# EAGLE design top plank (EAGLE 6.2)
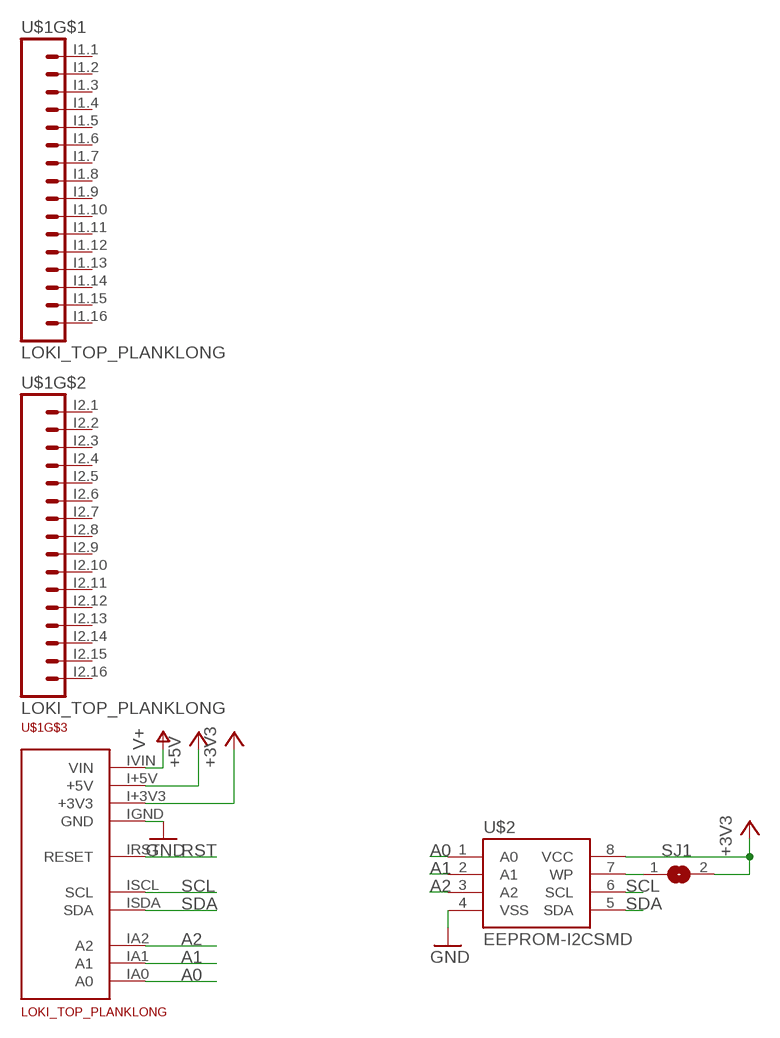
[diagram p0: schematic, sheet 1]

## Parts
SJ1  SJ  [SJ]
U$1  LOKI_TOP_PLANKLONG  [TOP_PLANK_LONG]
U$2  EEPROM-I2CSMD  [SO08]

## Nets
+3V3: SJ1.2 U$1.I+3V3(+3V3) U$2.8(VCC)
+5V: U$1.I+5V(+5V)
A0: U$1.IA0(A0) U$2.1(A0)
A1: U$1.IA1(A1) U$2.2(A1)
A2: U$1.IA2(A2) U$2.3(A2)
GND: U$1.IGND(GND) U$2.4(VSS)
N$1: SJ1.1 U$2.7(WP)
RST: U$1.IRST(RESET)
SCL: U$1.ISCL(SCL) U$2.6(SCL)
SDA: U$1.ISDA(SDA) U$2.5(SDA)
V+: U$1.IVIN(VIN)
Unconnected: U$1.I1.1 U$1.I1.2 U$1.I1.3 U$1.I1.4 U$1.I1.5 U$1.I1.6 U$1.I1.7 U$1.I1.8 U$1.I1.9 U$1.I1.10 U$1.I1.11 U$1.I1.12 U$1.I1.13 U$1.I1.14 U$1.I1.15 U$1.I1.16 U$1.I2.1 U$1.I2.2 U$1.I2.3 U$1.I2.4 U$1.I2.5 U$1.I2.6 U$1.I2.7 U$1.I2.8 U$1.I2.9 U$1.I2.10 U$1.I2.11 U$1.I2.12 U$1.I2.13 U$1.I2.14 U$1.I2.15 U$1.I2.16

## Library data of the parts
SJ1 = jumper:SJ: SMD solder JUMPER
U$1 = loki:LOKI_TOP_PLANK: Top plank template for Loki. For planks that cannot have others stacked on them.
U$2 = SparkFun-DigitalIC:EEPROM-I2C: I2C EEPROM chips, 24LC256 (and others)

## Board
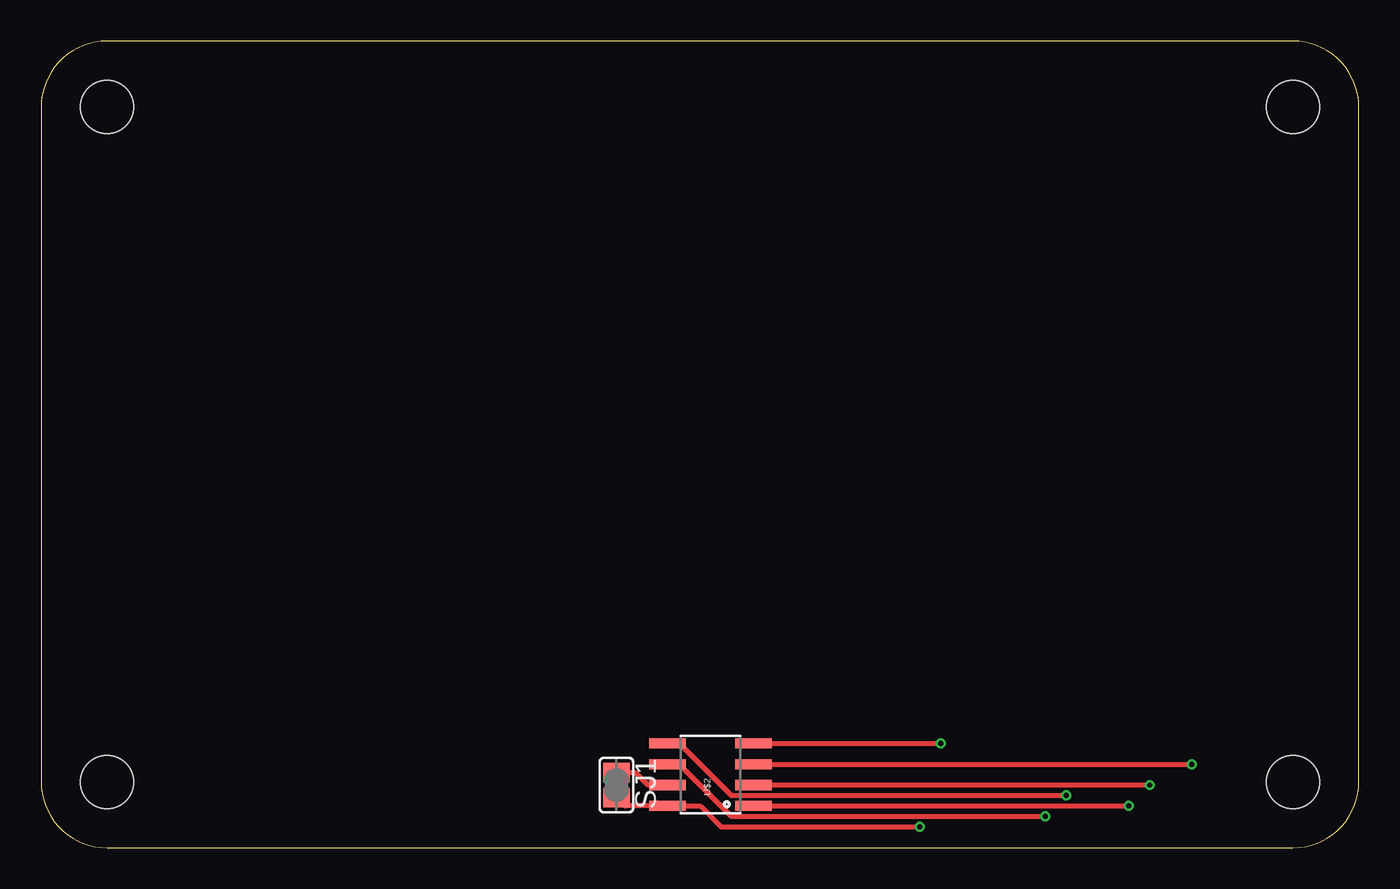
[diagram p1: board, top side]
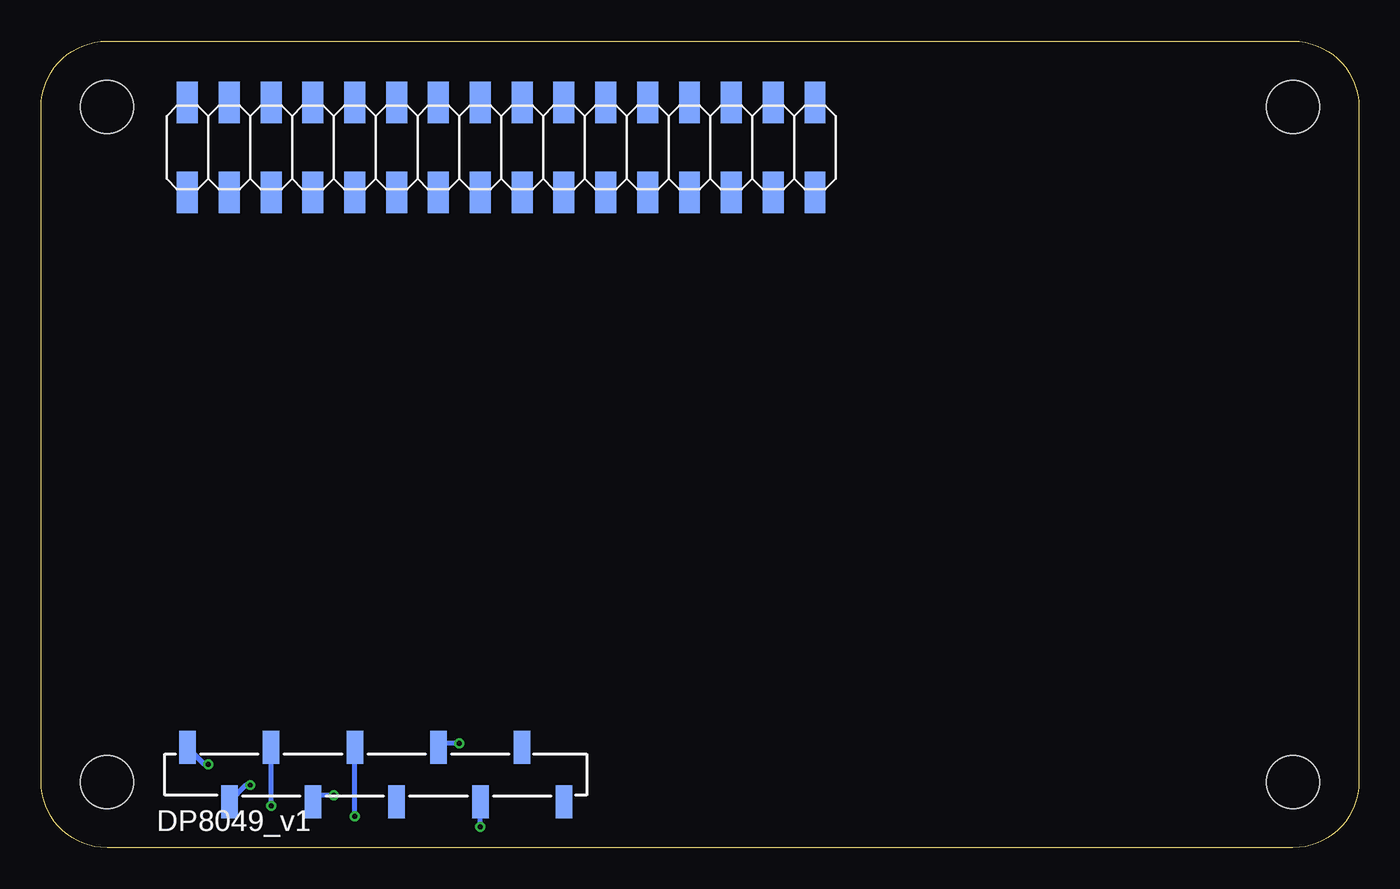
[diagram p2: board, bottom side, seen from below]

Size 80 x 49 mm. Coordinates in mm from the lower left corner, seen from the top.
Copper layers (1*16): Top 0.035mm / dielectric 1.5mm / Bottom 0.035mm
Design rules: minimum track width 6mil, minimum drill 0.3mm, track to track 6mil, track to pad 6mil, pad to pad 6mil, via to via 6mil, smd to smd 0mil, copper to edge 10mil, drill to drill 10mil, minimum pad ring 10mil, minimum via ring 6mil, stop-mask expansion 2mil, vias tented up to drill 100mil, thermal gap 10mil

### Footprints (pad centres in the part's own frame; a part is rotated, then mirrored left to right if it is on the bottom)
SJ = smd 1.168 x 1.6: 1 -0.762,0; 2 0.762,0
TOP_PLANK_LONG = smd 1.27 x 2.54 bottom: I1.1 71.12,45.275; I1.2 71.12,39.815; I1.3 68.58,45.275; I1.4 68.58,39.815; I1.5 66.04,45.275; I1.6 66.04,39.815; I1.7 63.5,45.275; I1.8 63.5,39.815; I1.9 60.96,45.275; I1.10 60.96,39.815; I1.11 58.42,45.275; I1.12 58.42,39.815; I1.13 55.88,45.275; I1.14 55.88,39.815; I1.15 53.34,45.275; I1.16 53.34,39.815; I2.1 50.8,45.275; I2.2 50.8,39.815; I2.3 48.26,45.275; I2.4 48.26,39.815; I2.5 45.72,45.275; I2.6 45.72,39.815; I2.7 43.18,45.275; I2.8 43.18,39.815; I2.9 40.64,45.275; I2.10 40.64,39.815; I2.11 38.1,45.275; I2.12 38.1,39.815; I2.13 35.56,45.275; I2.14 35.56,39.815; I2.15 33.02,45.275; I2.16 33.02,39.815 | smd 1 x 2 bottom: I+3V3 53.34,2.795; I+5V 50.8,6.095; IA0 66.04,6.095; IA1 68.58,2.795; IA2 71.12,6.095; IGND 55.88,6.095; IRST 58.42,2.795; ISCL 60.96,6.095; ISDA 63.5,2.795; IVIN 48.26,2.795 | hole 3.2: 4,4; 76,4; 76,45; 4,45
SO08 = smd 0.61 x 2.21: 1 -1.905,-2.616; 2 -0.635,-2.616; 3 0.635,-2.616; 4 1.905,-2.616; 5 1.905,2.616; 6 0.635,2.616; 7 -0.635,2.616; 8 -1.905,2.616

### Placement (x,y rotation side)
SJ1  34.92,3.81 270 top
U$1  0,0 0 top
U$2  40.64,4.45 90 top

### Tracks (layer width: path | path; a pad name or v marks a point on that pad's centre or on a via)
+3V3  (via drill 0.3)
  Top 0.305: v53.34,1.27 41.27,1.27 40.01,2.54 U$2.8 35.43,2.54 SJ1.2
  Bottom 0.305: v53.34,1.27 U$1.I+3V3
A0  (via drill 0.3)
  Top 0.305: U$2.1 v66.04,2.54
  Bottom 0.305: v66.04,2.54 U$1.IA0
A1  (via drill 0.3)
  Top 0.305: U$2.2 v67.31,3.81
  Bottom 0.305: v67.31,3.81 67.56,3.81 U$1.IA1
A2  (via drill 0.3)
  Top 0.305: U$2.3 v69.85,5.08
  Bottom 0.305: v69.85,5.08 70.11,5.08 U$1.IA2
GND  (via drill 0.3)
  Top 0.305: U$2.4 v54.61,6.35
  Bottom 0.305: v54.61,6.35 55.62,6.35 U$1.IGND
N$1
  Top 0.305: SJ1.1 36.07,4.57 36.83,3.81 U$2.7
SCL  (via drill 0.3)
  Top 0.305: U$2.6 38.73,5.08 41.91,1.91 v60.96,1.91
  Bottom 0.305: v60.96,1.91 U$1.ISCL
SDA  (via drill 0.3)
  Top 0.305: U$2.5 38.73,6.35 41.91,3.17 v62.23,3.17
  Bottom 0.305: v62.23,3.17 63.12,3.17 U$1.ISDA